# EAGLE design button board v0.3.3 (EAGLE 7.3.0)
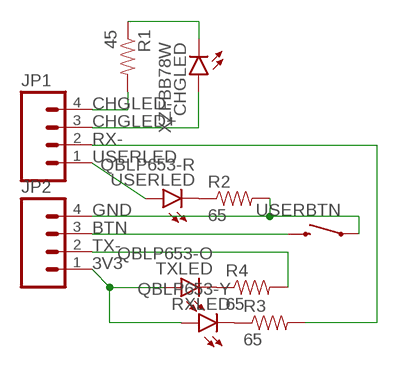
[diagram p0: schematic, sheet 1]

## Parts
CHGLED  XZFBB78W  LED1208  [LED-1208]
JP1  M04PTH  [1X04]
JP2  M04PTH  [1X04]
R1  45  RESISTOR0603-RES  [0603-RES]
R2  65  RESISTOR0603-RES  [0603-RES]
R3  65  RESISTOR0603-RES  [0603-RES]
R4  65  RESISTOR0603-RES  [0603-RES]
RXLED  QBLP653-Y  LED1208  [LED-1208]
TXLED  QBLP653-O  LED1208  [LED-1208]
USERBTN  SWITCH-MOMENTARY-2PCB_MOUNTSMD_OMRON_B3S_100X  [TACTILE_SWITCH_LARGE]
USERLED  QBLP653-R  LED1208  [LED-1208]

## Nets
3V3: JP2.1 RXLED.A TXLED.A
BTN: JP2.3 USERBTN.3 USERBTN.4
CHGLED+: CHGLED.A JP1.3
CHGLED-: JP1.4 R1.2
GND: JP2.4 R2.2 USERBTN.1 USERBTN.2
N$1: CHGLED.C R1.1
N$2: R3.1 RXLED.C
N$3: R2.1 USERLED.C
N$4: R4.1 TXLED.C
RX-: JP1.2 R3.2
TX-: JP2.2 R4.2
USERLED: JP1.1 USERLED.A

## Library data of the parts
CHGLED RXLED TXLED USERLED = SparkFun-LED:LED: LEDs Standard schematic elements and footprints for 5mm, 3mm, 1206, and 0603 sized LEDs. 5mm - Spark Fun Electronics SKU : COM-00529 (and others)
JP1 JP2 = SparkFun-Connectors:M04: Header 4 Standard 4-pin 0.1" header. Use with straight break away headers (SKU : PRT-00116), right angle break away headers (PRT-00553), swiss pins (PRT-00743), machine pins (PRT-00117), and female headers (PRT-00115). Molex polarized connector foot print use with SKU : PRT-08231 with associated crimp pins and housings. 1MM SMD Version SKU: PRT-10208
R1-R4 = SparkFun-Passives:RESISTOR: Resistor Basic schematic elements and footprints for 0603, 1206, and PTH resistors.
USERBTN = comingle:SWITCH-MOMENTARY-2: Various NO switches- pushbuttons, reed, etc

## Board
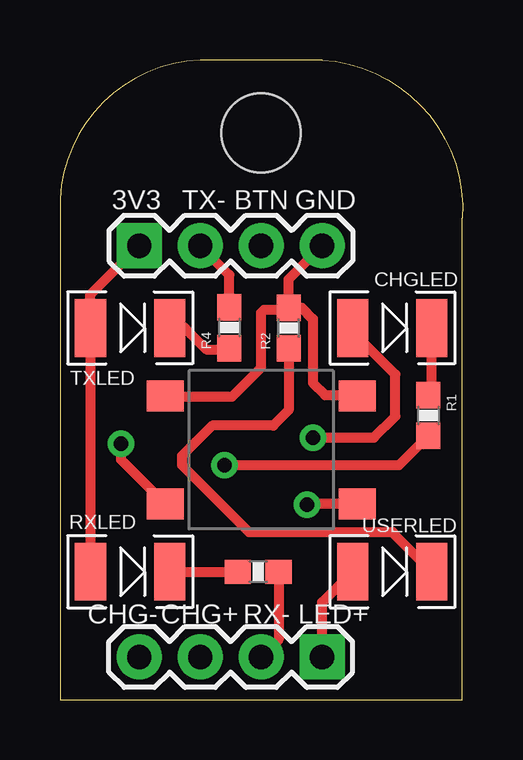
[diagram p1: board, top side]
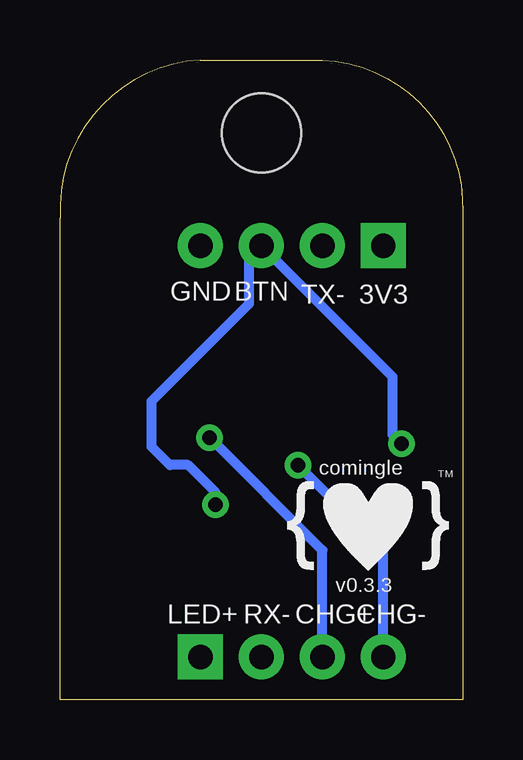
[diagram p2: board, bottom side, seen from below]

Size 16.77 x 26.67 mm. Coordinates in mm from the lower left corner, seen from the top.
Outline: 0,0 16.76,0 16.76,20.07 arc90 10.92,26.67 5.84,26.67 arc90 0,20.32 0,0
Copper layers (1*16): Top 0.035mm / dielectric 1.5mm / Bottom 0.035mm
Design rules "SparkFun-2-layer": minimum track width 7mil, minimum drill 15mil, track to track 8mil, track to pad 8mil, pad to pad 8mil, via to via 8mil, smd to smd 8mil, copper to edge 8mil, drill to drill 8mil, minimum pad ring 12mil, minimum via ring 10mil, stop-mask expansion 4mil, vias tented up to drill 20mil, thermal gap 10mil

### Footprints (pad centres in the part's own frame; a part is rotated, then mirrored left to right if it is on the bottom)
LED-1208 = smd 1.3 x 2.4: A -1.65,0; C 1.65,0
1X04 = drill 1.016 pad 1.88 square: 1 0,0 | drill 1.016 pad 1.88: 2 2.54,0; 3 5.08,0; 4 7.62,0
0603-RES = smd 1.1 x 1: 1 -0.85,0; 2 0.85,0
STAND-OFF = hole 3.302: 0,0
TACTILE_SWITCH_LARGE = smd 1.55 x 1.3: 1 4,-2.25; 2 -4,-2.25; 3 4,2.25; 4 -4,2.25

### Placement (x,y rotation side)
CHGLED  13.84,15.49 0 top
JP1  10.92,1.78 180 top
JP2  3.3,18.92 0 top
R1  15.35,11.85 270 top
R2  9.53,15.49 90 top
R3  8.26,5.33 0 top
R4  7.06,15.51 90 top
RXLED  2.92,5.33 0 top
TXLED  2.92,15.49 0 top
U$1  [STAND-OFF]  8.38,23.62 0 top
USERBTN  8.38,10.41 180 top
USERLED  13.84,5.33 0 top

### Tracks (layer width: path | path; a pad name or v marks a point on that pad's centre or on a via)
3V3
  Top 0.406: 1.24,16.86 JP2.1 | 1.24,16.86 1.27,16.86 | RXLED.A TXLED.A 1.24,15.52 1.24,16.86
BTN  (via drill 0.6)
  Top 0.406: v2.54,10.67 2.54,10.01 USERBTN.3 | v10.29,8.13 10.32,8.16 USERBTN.4
  Bottom 0.406: v2.54,10.67 2.92,11.05 2.92,13.46 JP2.3 8.89,18.41 8.89,16.51 12.95,12.45 12.95,10.54 12.19,9.78 11.43,9.78 10.29,8.64 v10.29,8.13
CHGLED+  (via drill 0.6)
  Top 0.406: v10.54,10.92 13.08,10.92 13.97,11.81 13.97,13.56 12.19,15.34 CHGLED.A
  Bottom 0.406: JP1.3 5.84,6.22 v10.54,10.92
CHGLED-  (via drill 0.6)
  Top 0.406: v6.86,9.78 14.13,9.78 R1.2
  Bottom 0.406: JP1.4 3.3,6.22 v6.86,9.78
GND
  Top 0.406: R2.2 9.53,17.53 JP2.4 | R2.2 10.07,16.34 10.54,15.88 10.54,13.21 11.05,12.7 12.35,12.7 USERBTN.2 | R2.2 9.44,16.26 8.51,16.26 8.38,16.13 8.38,13.84 7.17,12.63 4.42,12.63 USERBTN.1
N$1
  Top 0.406: R1.1 15.49,12.7 CHGLED.C
N$2
  Top 0.406: RXLED.C R3.1
N$3
  Top 0.406: R2.1 9.53,12.07 8.89,11.43 6.35,11.43 5.08,10.16 5.08,9.78 7.87,6.99 13.87,6.99 13.87,6.96 USERLED.C
N$4
  Top 0.406: R4.1 7.01,14.61 6.1,14.61 5.21,15.49 TXLED.C
RX-
  Top 0.406: R3.2 9.11,2.5 JP1.2
TX-
  Top 0.406: R4.2 7.06,17.7 JP2.2
USERLED
  Top 0.406: JP1.1 10.92,4.06 USERLED.A

### Text on the board
tPlace: 3V3 | TX- | BTN | GND | CHG- | CHG+ | RX- | LED+
bPlace: 3V3 | TX- | BTN | GND | TM | comingle | v0.3.3 | CHG- | CHG+ | RX- | LED+